# EAGLE design Genny Joypad to Atari Adapter (EAGLE 7.1.0)
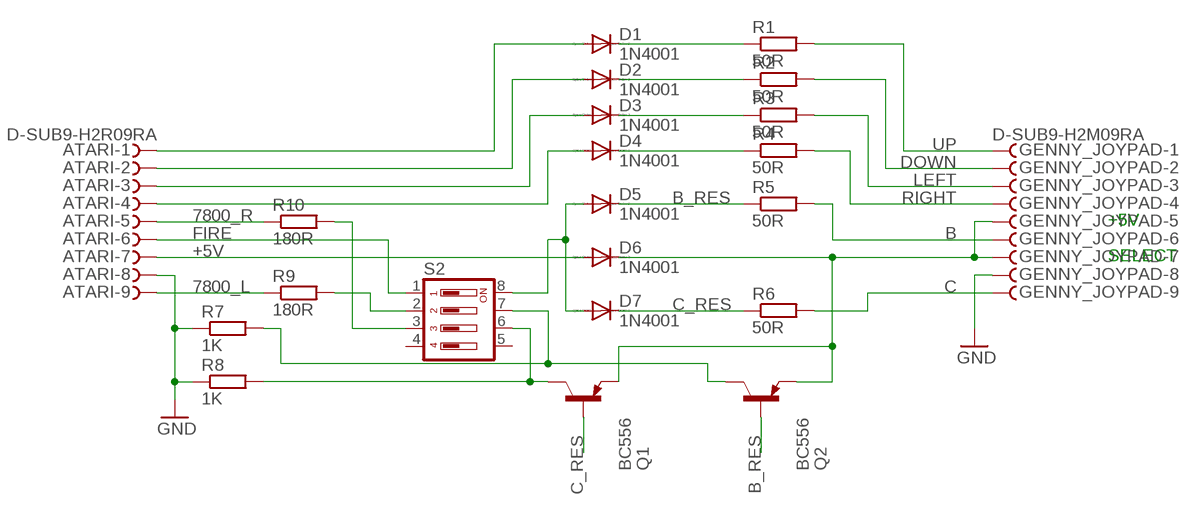
[diagram p0: schematic, sheet 1]

## Parts
ATARI  D-SUB9-H2R09RA  [H2R09RA]
D1  1N4001  1N4148DO35-7  [DO35-7]
D2  1N4001  1N4148DO35-7  [DO35-7]
D3  1N4001  1N4148DO35-7  [DO35-7]
D4  1N4001  1N4148DO35-7  [DO35-7]
D5  1N4001  1N4148DO35-7  [DO35-7]
D6  1N4001  1N4148DO35-7  [DO35-7]
D7  1N4001  1N4148DO35-7  [DO35-7]
GENNY_JOYPAD  D-SUB9-H2M09RA  [H2M09RA]
Q1  BC556  [TO92-EBC]
Q2  BC556  [TO92-EBC]
R1  50R  R-EU_0204/7  [0204/7]
R2  50R  R-EU_0204/7  [0204/7]
R3  50R  R-EU_0204/7  [0204/7]
R4  50R  R-EU_0204/7  [0204/7]
R5  50R  R-EU_0204/7  [0204/7]
R6  50R  R-EU_0204/7  [0204/7]
R7  1K  R-EU_0204/7  [0204/7]
R8  1K  R-EU_0204/7  [0204/7]
R9  180R  R-EU_0204/7  [0204/7]
R10  180R  R-EU_0204/7  [0204/7]
S2  DIP04YL  [DIP04YL]

## Nets
7800_L: ATARI.9 R9.1
7800_R: ATARI.5 R10.1
+5V: D6.C GENNY_JOYPAD.5 GENNY_JOYPAD.7 Q1.E Q2.E
B: GENNY_JOYPAD.6 R5.2
B_PNP: Q2.C R7.2 S2.7
B_RES: D5.C Q2.B R5.1
C: GENNY_JOYPAD.9 R6.2
C_PNP: Q1.C R8.2 S2.6
C_RES: D7.C Q1.B R6.1
DOWN: GENNY_JOYPAD.2 R2.2
FIRE: D5.A D7.A S2.8
GND: ATARI.8 GENNY_JOYPAD.8 R7.1 R8.1
LEFT: GENNY_JOYPAD.3 R3.2
N$1: D1.C R1.1
N$2: ATARI.7 D6.A
N$3: ATARI.1 D1.A
N$4: D2.C R2.1
N$5: ATARI.2 D2.A
N$6: D3.C R3.1
N$7: ATARI.3 D3.A
N$8: D4.C R4.1
N$9: ATARI.4 D4.A
N$10: ATARI.6 S2.1
N$11: R9.2 S2.2
N$12: R10.2 S2.3
RIGHT: GENNY_JOYPAD.4 R4.2
UP: GENNY_JOYPAD.1 R1.2
Unconnected: S2.4 S2.5

## Notes on the sheet
- +5V
- SELECT

## Library data of the parts
ATARI GENNY_JOYPAD = con-thomas-betts:D-SUB9-: D-Subminiatur Connector Source: Electronioc Interconnects European Edition 1998; OC_FARNELL: unknown; OC_NEWARK: unknown
D1-D7 = diode:1N4148: DIODE high speed (Philips)
Q1 Q2 = transistor-pnp:BC556*: PNP Transistror
R1-R10 = rcl:R-EU_: RESISTOR, European symbol
S2 = switch-dil:DIP04YL: DIL/CODE SWITCH; OC_FARNELL: unknown; OC_NEWARK: unknown

## Board
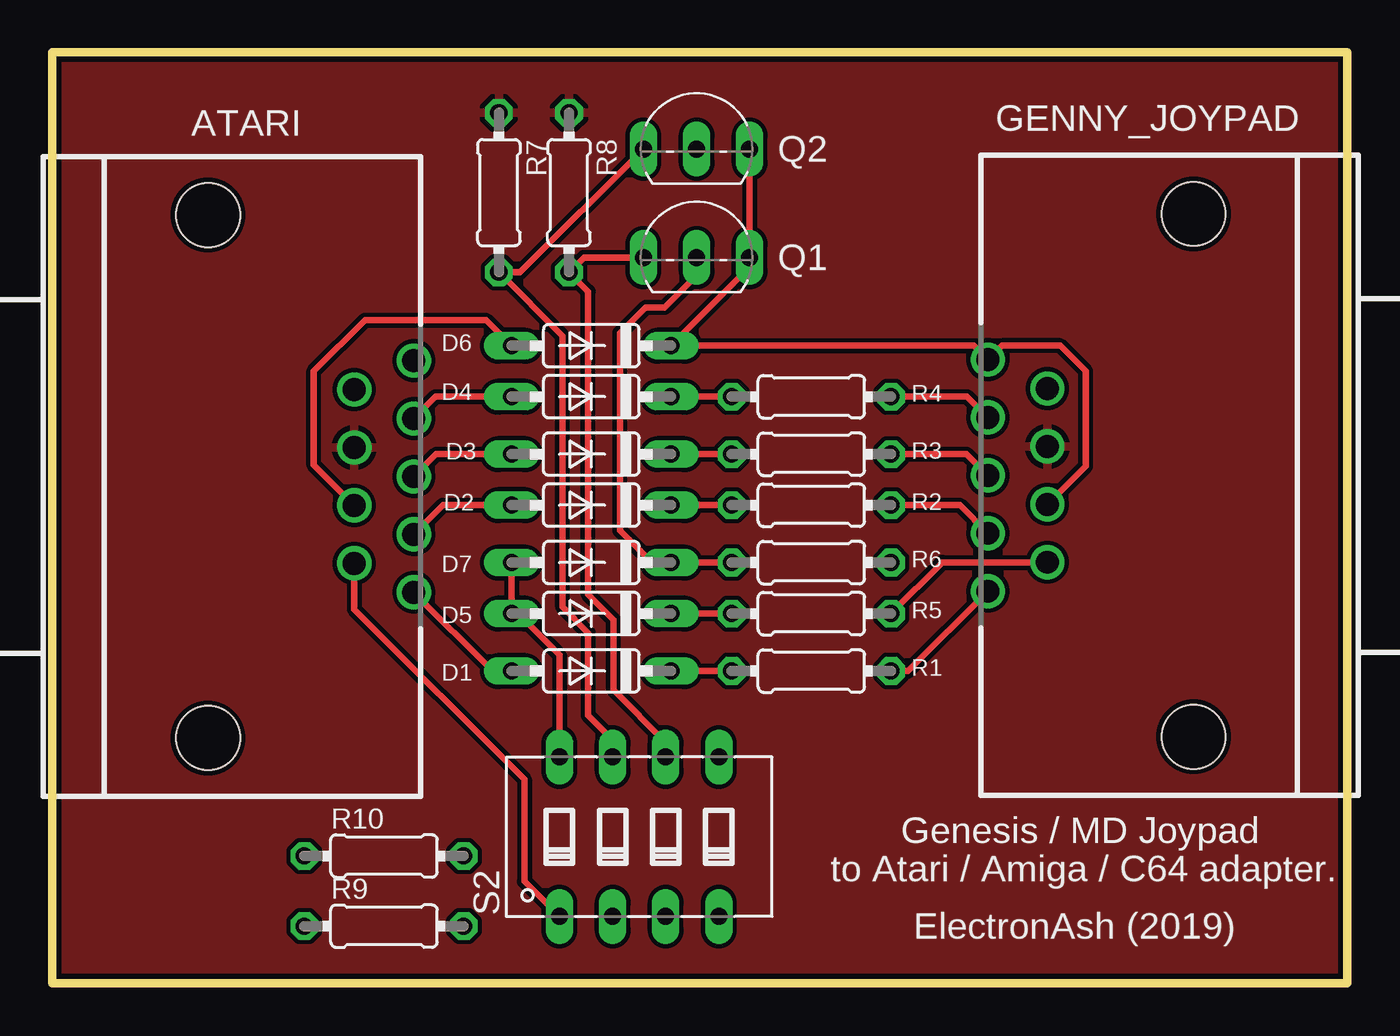
[diagram p1: board, top side]
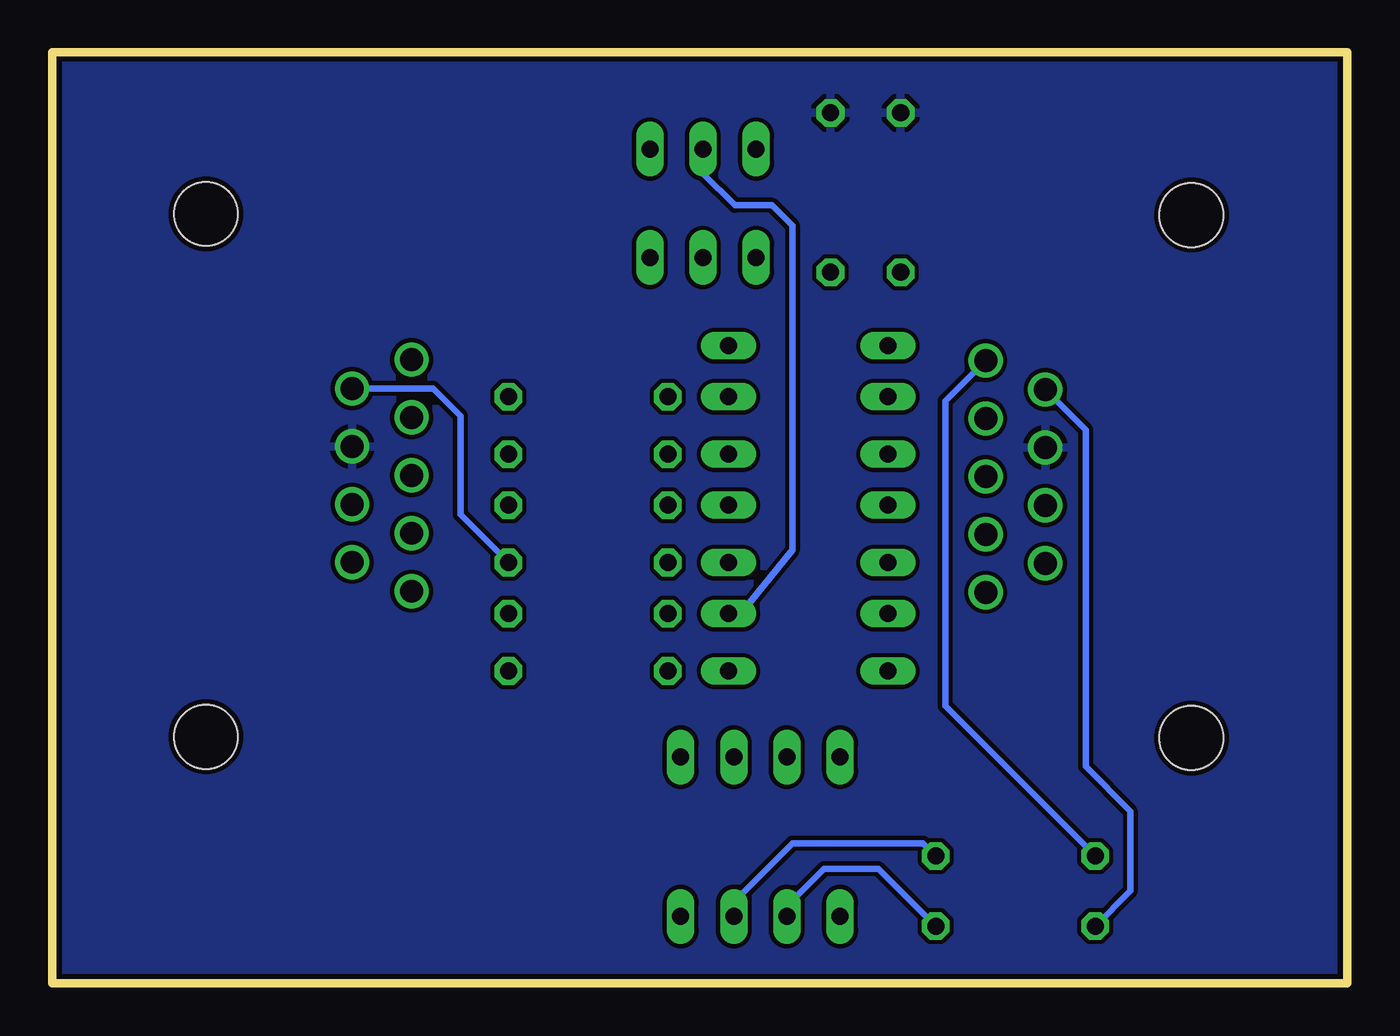
[diagram p2: board, bottom side, seen from below]

Size 61.87 x 44.5 mm. Coordinates in mm from the lower left corner, seen from the top.
Outline: 0,44.5 61.87,44.5 61.87,0 0,0 0,44.5
Copper layers (1*16): Top 0.035mm / dielectric 1.5mm / Bottom 0.035mm
Design rules "default *": minimum track width 10mil, minimum drill 24mil, track to track 8mil, track to pad 8mil, pad to pad 8mil, via to via 8mil, smd to smd 8mil, copper to edge 10mil, drill to drill 8mil, minimum pad ring 10mil, minimum via ring 8mil, stop-mask expansion 4mil, vias tented up to drill 0mil, thermal gap 10mil

### Footprints (pad centres in the part's own frame; a part is rotated, then mirrored left to right if it is on the bottom)
H2R09RA = drill 1.092: 1 5.537,7.925; 2 2.769,7.925; 3 0,7.925; 4 -2.769,7.925; 5 -5.537,7.925; 6 4.153,5.08; 7 1.384,5.08; 8 -1.384,5.08; 9 -4.153,5.08 | hole 3.048: -12.497,-1.905; 12.497,-1.905
DO35-7 = drill 0.813 long: A 3.81,0; C -3.81,0
H2M09RA = drill 1.092: 1 -5.537,7.925; 2 -2.769,7.925; 3 0,7.925; 4 2.769,7.925; 5 5.537,7.925; 6 -4.153,5.08; 7 -1.384,5.08; 8 1.384,5.08; 9 4.153,5.08 | hole 3.048: -12.497,-1.905; 12.497,-1.905
TO92-EBC = drill 0.813 long: B 0,-1.27; C -2.54,-1.27; E 2.54,-1.27
0204/7 = drill 0.813 octagon: 1 -3.81,0; 2 3.81,0
DIP04YL = drill 0.813 long: 1 -3.81,-3.81; 2 -1.27,-3.81; 3 1.27,-3.81; 4 3.81,-3.81; 5 3.81,3.81; 6 1.27,3.81; 7 -1.27,3.81; 8 -3.81,3.81

### Placement (x,y rotation side)
ATARI  9.35,24.23 270 top
D1  25.76,14.94 180 top
D2  25.76,22.86 180 top
D3  25.76,25.3 180 top
D4  25.76,28.04 180 top
D5  25.76,17.68 180 top
D6  25.76,30.48 180 top
D7  25.76,20.12 180 top
GENNY_JOYPAD  52.63,24.28 90 top
Q1  30.78,35.97 0 top
Q2  30.78,41.15 0 top
R1  36.27,14.94 0 top
R2  36.27,22.86 0 top
R3  36.27,25.3 0 top
R4  36.27,28.04 0 top
R5  36.27,17.68 0 top
R6  36.27,20.12 0 top
R7  21.34,37.8 270 top
R8  24.69,37.8 270 top
R9  15.85,2.74 0 top
R10  15.85,6.1 0 top
S2  28.04,7.01 0 top

### Tracks (layer width: path | path; a pad name or v marks a point on that pad's centre or on a via)
7800_L
  Bottom 0.305: ATARI.9 12.5,26.45 12.5,10.36 10.36,8.23 10.36,4.42 R9.1
7800_R
  Bottom 0.305: ATARI.5 19.2,27.84 19.2,13.26 R10.1
+5V
  Top 0.305: GENNY_JOYPAD.7 49.38,24.73 49.38,29.26 48.16,30.48 45.36,30.48 GENNY_JOYPAD.5 44.04,30.48 D6.C 33.32,34.24 Q1.E Q2.E
B
  Top 0.305: R5.2 42.53,20.13 GENNY_JOYPAD.6
B_PNP
  Top 0.305: Q2.C 22.35,33.99 R7.2 24.38,30.94 24.38,17.98 25.6,16.76 25.6,12.8 26.77,11.63 S2.7
B_RES
  Top 0.305: D5.C R5.1
  Bottom 0.305: D5.C 28.96,17.68 26.52,20.73 26.52,36.22 27.48,37.19 29.26,37.19 30.78,38.71 Q2.B
C
  Bottom 0.305: R6.2 42.37,22.4 42.37,27.13 43.68,28.44 GENNY_JOYPAD.9
C_PNP
  Top 0.305: Q1.C 25.4,34.7 R8.2 25.6,33.07 25.6,18.59 26.82,17.37 26.82,14.02 29.31,11.53 S2.6
C_RES
  Top 0.305: R6.1 D7.C 28.65,20.12 27.13,21.64 27.13,31.09 28.35,32.31 29.26,32.31 30.78,33.83 Q1.B
DOWN
  Top 0.305: R2.2 43.36,22.86 GENNY_JOYPAD.2
FIRE
  Top 0.305: D7.A D5.A 22.25,17.68 24.23,15.7 S2.8
GND
  pour Top: 0,44.5 61.87,44.5 61.87,0 0,0
  pour Bottom: 0,44.5 61.87,44.5 61.87,0 0,0
LEFT
  Top 0.305: R3.2 43.69,25.3 GENNY_JOYPAD.3
N$1
  Top 0.305: D1.C R1.1
N$2
  Top 0.305: ATARI.7 12.5,24.78 12.5,29.26 14.94,31.7 20.73,31.7 D6.A
N$3
  Top 0.305: ATARI.1 21.03,14.94 D1.A
N$4
  Top 0.305: D2.C R2.1
N$5
  Top 0.305: ATARI.2 18.67,22.86 D2.A
N$6
  Top 0.305: D3.C R3.1
N$7
  Top 0.305: ATARI.3 18.34,25.3 D3.A
N$8
  Top 0.305: D4.C R4.1
N$9
  Top 0.305: ATARI.4 18.31,28.04 D4.A
N$10
  Top 0.305: ATARI.6 14.43,17.88 22.56,9.75 22.56,4.88 S2.1
N$11
  Bottom 0.305: R9.2 22.4,5.49 24.99,5.49 26.77,3.71 S2.2
N$12
  Bottom 0.305: R10.2 20.27,6.71 26.52,6.71 29.31,3.91 S2.3
RIGHT
  Top 0.305: R4.2 43.71,28.04 GENNY_JOYPAD.4
UP
  Top 0.305: R1.2 40.89,14.94 GENNY_JOYPAD.1

### Text on the board
tPlace: Genesis / MD Joypad | to Atari / Amiga / C64 adapter. | ElectronAsh (2019)